# Altium schematic sheet Printing.SchDoc (part 1 of 2)
size A2; Organization: Altium Limited; Address1: L3, 12a Rodborough Rd; Address2: Frenchs Forest; Address3: NSW; Address4: Australia 2086
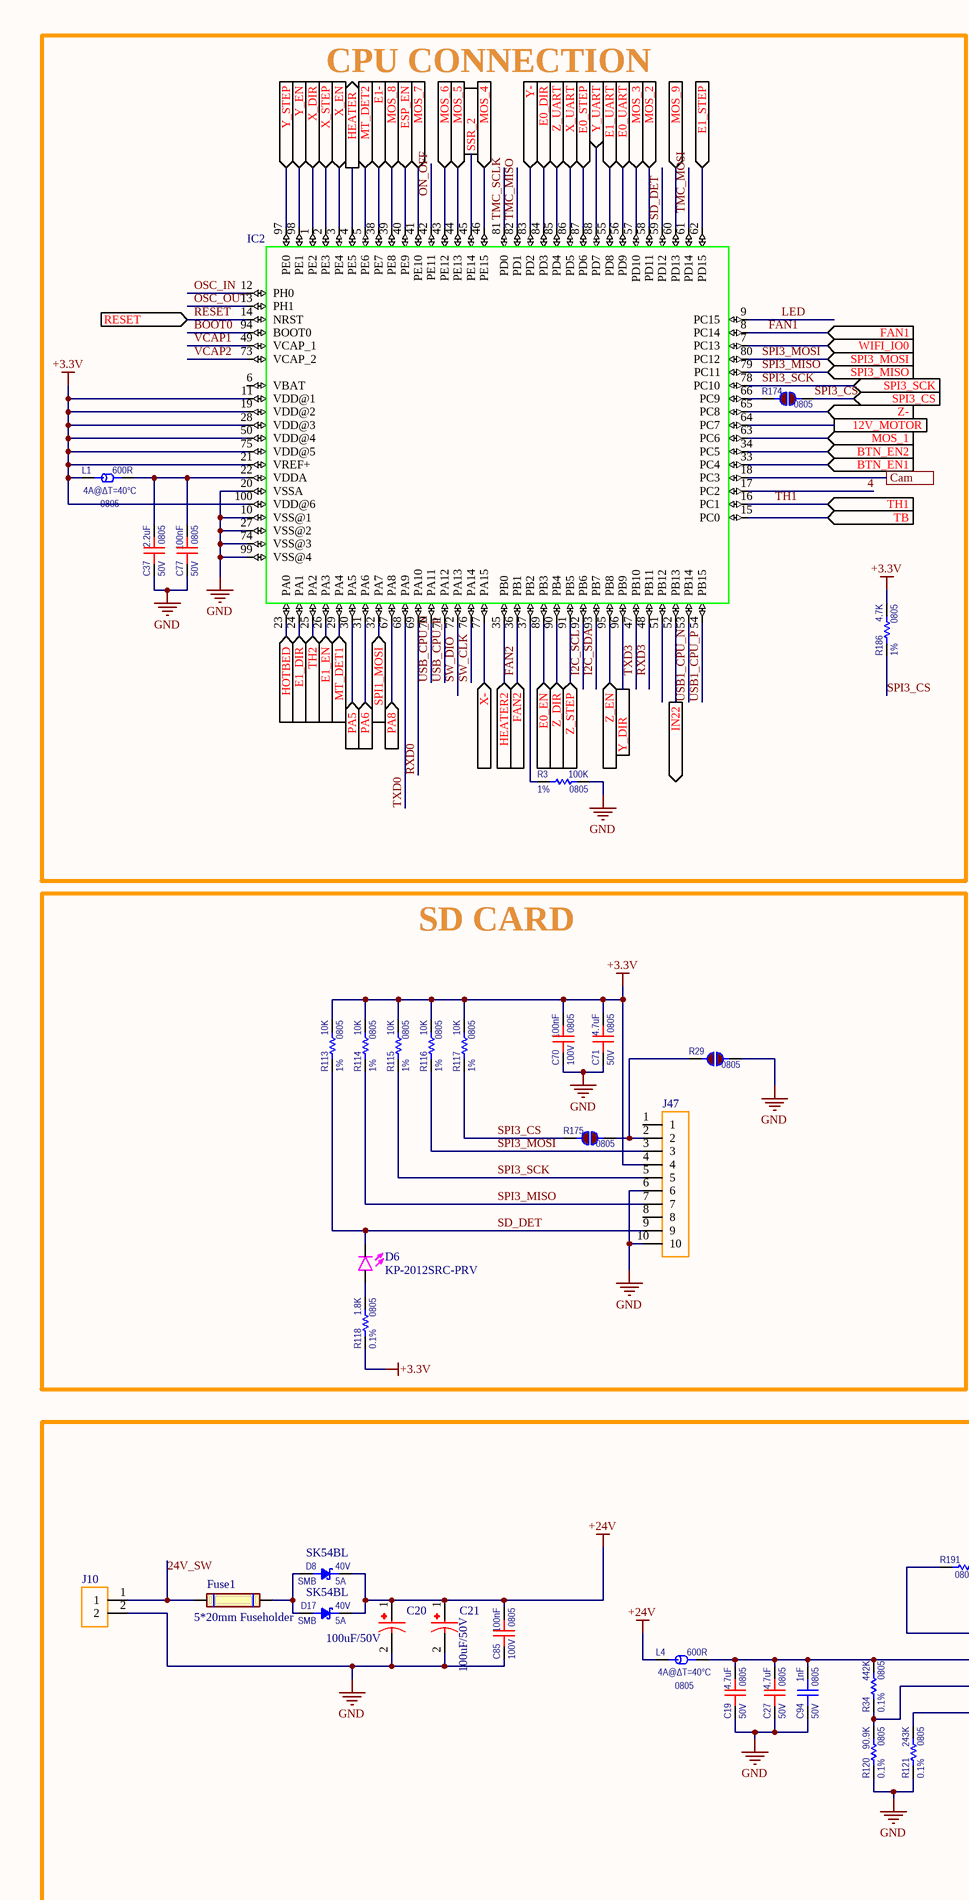
[diagram p0: Printing.SchDoc, left]
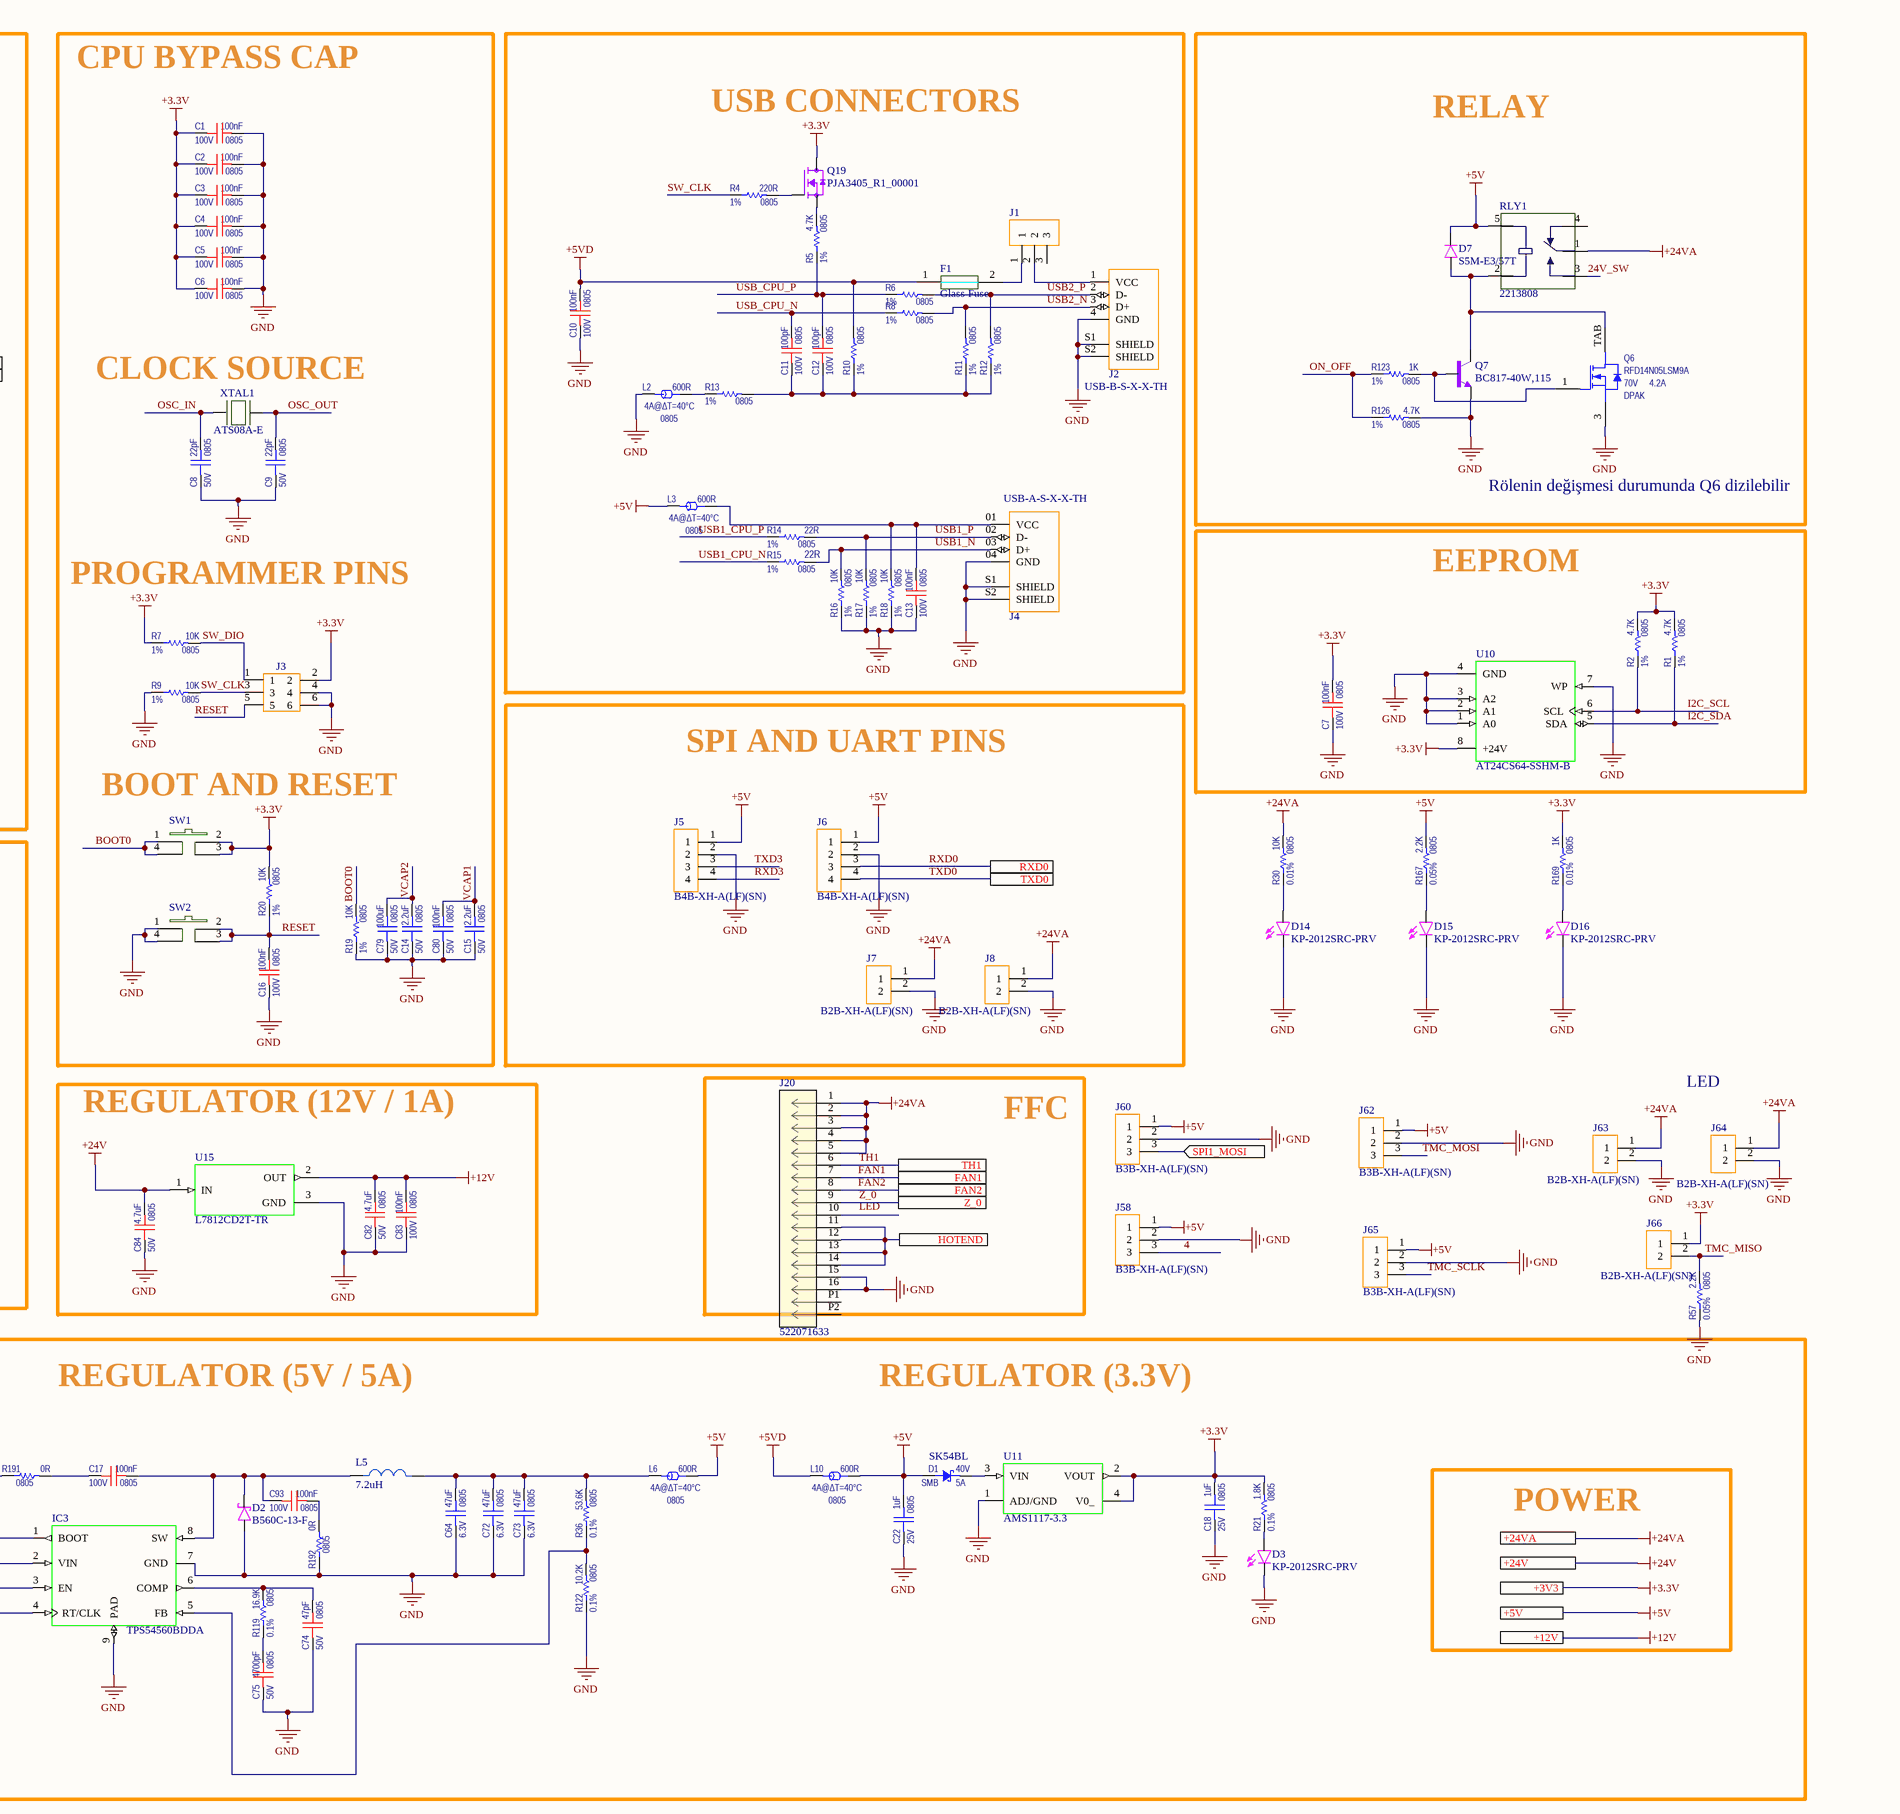
[diagram p1: Printing.SchDoc, right]

## Parts
C1  value 100nF  Voltage: 100V  Package: 0805  [C_0805_GEN_1.40H]  (hidden comment: ESDSafeCapacitor)
C2  value 100nF  Voltage: 100V  Package: 0805  [C_0805_GEN_1.40H]  (hidden comment: ESDSafeCapacitor)
C3  value 100nF  Voltage: 100V  Package: 0805  [C_0805_GEN_1.40H]  (hidden comment: ESDSafeCapacitor)
C4  value 100nF  Voltage: 100V  Package: 0805  [C_0805_GEN_1.40H]  (hidden comment: ESDSafeCapacitor)
C5  value 100nF  Voltage: 100V  Package: 0805  [C_0805_GEN_1.40H]  (hidden comment: ESDSafeCapacitor)
C6  value 100nF  Voltage: 100V  Package: 0805  [C_0805_GEN_1.40H]  (hidden comment: ESDSafeCapacitor)
C7  value 100nF  Voltage: 100V  Package: 0805  [C_0805_GEN_1.40H]  (hidden comment: ESDSafeCapacitor)
C8  value 22pF  Voltage: 50V  Package: 0805  [C_0805_GEN_1.10H]  (hidden comment: Capacitor)
C9  value 22pF  Voltage: 50V  Package: 0805  [C_0805_GEN_1.10H]  (hidden comment: Capacitor)
C10  value 100nF  Voltage: 100V  Package: 0805  [C_0805_GEN_1.40H]  (hidden comment: ESDSafeCapacitor)
C11  value 100pF  Voltage: 100V  Package: 0805  [C_0805_GEN_1.40H]  (hidden comment: ESDSafeCapacitor)
C12  value 100pF  Voltage: 100V  Package: 0805  [C_0805_GEN_1.40H]  (hidden comment: ESDSafeCapacitor)
C13  value 100nF  Voltage: 100V  Package: 0805  [C_0805_GEN_1.40H]  (hidden comment: ESDSafeCapacitor)
C14  value 2.2uF  Voltage: 50V  Package: 0805  [C_0805_GEN_1.40H]  (hidden comment: Capacitor)
C15  value 2.2uF  Voltage: 50V  Package: 0805  [C_0805_GEN_1.40H]  (hidden comment: Capacitor)
C16  value 100nF  Voltage: 100V  Package: 0805  [C_0805_GEN_1.40H]  (hidden comment: ESDSafeCapacitor)
C17  value 100nF  Voltage: 100V  Package: 0805  [C_0805_GEN_1.40H]  (hidden comment: ESDSafeCapacitor)
C18  value 1uF  Voltage: 25V  Package: 0805  [C_0805_GEN_1.40H]  (hidden comment: Capacitor)
C19  value 4.7uF  Voltage: 50V  Package: 0805  [C_0805_GEN_1.40H]  (hidden comment: ESDSafeCapacitor)
C20  100uF/50V  [SC1V107M6L07KVR]
C21  100uF/50V  [SC1V107M6L07KVR]
C22  value 1uF  Voltage: 25V  Package: 0805  [C_0805_GEN_1.40H]  (hidden comment: Capacitor)
C27  value 4.7uF  Voltage: 50V  Package: 0805  [C_0805_GEN_1.40H]  (hidden comment: ESDSafeCapacitor)
C37  value 2.2uF  Voltage: 50V  Package: 0805  [C_0805_GEN_1.40H]  (hidden comment: ESDSafeCapacitor)
C64  value 47uF  Voltage: 6.3V  Package: 0805  [C_0805_GEN_1.40H]  (hidden comment: Capacitor)
C70  value 100nF  Voltage: 100V  Package: 0805  [C_0805_GEN_1.40H]  (hidden comment: ESDSafeCapacitor)
C71  value 4.7uF  Voltage: 50V  Package: 0805  [C_0805_GEN_1.40H]  (hidden comment: ESDSafeCapacitor)
C72  value 47uF  Voltage: 6.3V  Package: 0805  [C_0805_GEN_1.40H]  (hidden comment: Capacitor)
C73  value 47uF  Voltage: 6.3V  Package: 0805  [C_0805_GEN_1.40H]  (hidden comment: Capacitor)
C74  value 47pF  Voltage: 50V  Package: 0805  [C_0805_GEN_1.40H]  (hidden comment: ESDSafeCapacitor)
C75  value 4700pF  Voltage: 50V  Package: 0805  [C_0805_GEN_1.40H]  (hidden comment: ESDSafeCapacitor)
C77  value 100nF  Voltage: 50V  Package: 0805  [C_0805_GEN_1.40H]  (hidden comment: ESDSafeCapacitor)
C79  value 100uF  Voltage: 50V  Package: 0805  [C_0805_GEN_1.40H]  (hidden comment: Capacitor)
C80  value 100nF  Voltage: 50V  Package: 0805  [C_0805_GEN_1.40H]  (hidden comment: Capacitor)
C82  value 4.7uF  Voltage: 50V  Package: 0805  [C_0805_GEN_1.40H]  (hidden comment: ESDSafeCapacitor)
C83  value 100nF  Voltage: 100V  Package: 0805  [C_0805_GEN_1.40H]  (hidden comment: ESDSafeCapacitor)
C84  value 4.7uF  Voltage: 50V  Package: 0805  [C_0805_GEN_1.40H]  (hidden comment: ESDSafeCapacitor)
C85  value 100nF  Voltage: 100V  Package: 0805  [C_0805_GEN_1.40H]  (hidden comment: ESDSafeCapacitor)
C93  value 100nF  Voltage: 100V  Package: 0805  [C_0805_GEN_1.40H]  (hidden comment: ESDSafeCapacitor)
C94  value 1nF  Voltage: 50V  Package: 0805  [C_0805_GEN_0.70H]  (hidden comment: Capacitor)
D1  SK54BL  Voltage: 40V  Current: 5A  Package: SMB  [SMB_NRVBS360BT3G]
D2  B560C-13-F  [B560C-13-F]
D3  KP-2012SRC-PRV  [0805 LED]
D6  KP-2012SRC-PRV  [0805 LED]
D7  S5M-E3/57T  [B560C-13-F]
D8  SK54BL  Voltage: 40V  Current: 5A  Package: SMB  [SMB_NRVBS360BT3G]
D14  KP-2012SRC-PRV  [0805 LED]
D15  KP-2012SRC-PRV  [0805 LED]
D16  KP-2012SRC-PRV  [0805 LED]
D17  SK54BL  Voltage: 40V  Current: 5A  Package: SMB  [SMB_NRVBS360BT3G]
F1  Glass Fuse  [2410 Sigorta]
Fuse1  5*20mm Fuseholder  [696310001002]
IC2  MCU-STM32F407VET6(LQFP100)  [LQFP100-0.5-13.8X13.8MM]  (value not drawn)
IC3  TPS54560BDDA  [VREG_LM5017MR/NOPB]
J1  L-KLS1-207-1-03-S  [L-KLS1-207-1-03-S]  (value not drawn)
J2  USB-B-S-X-X-TH  [SAMTEC_USB-B-S-X-X-TH]
J3  5PH1SDA25-203G0NNBL-3X6  [5PH1SDA25-203G0NNBL-3X6]  (value not drawn)
J4  USB-A-S-X-X-TH  [SAMTEC_USB-A-S-X-X-TH]
J5  B4B-XH-A(LF)(SN)  [JST_B4B-XH-A(LF)(SN)]
J6  B4B-XH-A(LF)(SN)  [JST_B4B-XH-A(LF)(SN)]
J7  B2B-XH-A(LF)(SN)  [JST_B2B-XH-A(LF)(SN)]
J8  B2B-XH-A(LF)(SN)  [JST_B2B-XH-A(LF)(SN)]
J10  5.08 Klemens  [5.08 Klemens]  (value not drawn)
J20  522071633  [CON_522071633_MOL]
J47  BH10B-XH-2(LF)(SN)  [BH10B-XH-2(LF)(SN)]  (value not drawn)
J58  B3B-XH-A(LF)(SN)  [JST_B3B-XH-A(LF)(SN)]
J60  B3B-XH-A(LF)(SN)  [JST_B3B-XH-A(LF)(SN)]
J62  B3B-XH-A(LF)(SN)  [JST_B3B-XH-A(LF)(SN)]
J63  B2B-XH-A(LF)(SN)  [JST_B2B-XH-A(LF)(SN)]
J64  B2B-XH-A(LF)(SN)  [JST_B2B-XH-A(LF)(SN)]
J65  B3B-XH-A(LF)(SN)  [JST_B3B-XH-A(LF)(SN)]
J66  B2B-XH-A(LF)(SN)  [JST_B2B-XH-A(LF)(SN)]
L1  value 600R  Current: 4A@ΔT=40°C  Package: 0805  [FB_0805_GEN_1.10H]  (hidden comment: FerriteBead)
L2  value 600R  Current: 4A@ΔT=40°C  Package: 0805  [FB_0805_GEN_1.10H]  (hidden comment: FerriteBead)
L3  value 600R  Current: 4A@ΔT=40°C  Package: 0805  [FB_0805_GEN_1.10H]  (hidden comment: FerriteBead)
L4  value 600R  Current: 4A@ΔT=40°C  Package: 0805  [FB_0805_GEN_1.10H]  (hidden comment: FerriteBead)
L5  7.2uH  [7447798720]
L6  value 600R  Current: 4A@ΔT=40°C  Package: 0805  [FB_0805_GEN_1.10H]  (hidden comment: FerriteBead)
L10  value 600R  Current: 4A@ΔT=40°C  Package: 0805  [FB_0805_GEN_1.10H]  (hidden comment: FerriteBead)
Q6  value RFD14N05LSM9A  Current: 4.2A  Voltage: 70V  Package: DPAK  [DPAK_SQD50N10-8M9L]  (hidden comment: SingleNMOS_G1S3DTAB)
Q7  BC817-40W,115  [BC817-40W,115]
Q19  PJA3405_R1_00001  [PJA3405_R1_00001]
R1  value 4.7K  Tolerance: 1%  Package: 0805  [R_0805_GEN_0.60H]  (hidden comment: StandardResistor)
R2  value 4.7K  Tolerance: 1%  Package: 0805  [R_0805_GEN_0.60H]  (hidden comment: StandardResistor)
R3  value 100K  Tolerance: 1%  Package: 0805  [R_0805_GEN_0.70H]  (hidden comment: StandardResistor)
R4  value 220R  Tolerance: 1%  Package: 0805  [R_0805_GEN_0.60H]  (hidden comment: StandardResistor)
R5  value 4.7K  Tolerance: 1%  Package: 0805  [R_0805_GEN_0.60H]  (hidden comment: StandardResistor)
R6  Tolerance: 1%  Package: 0805  [R_0805_GEN_0.60H]  (hidden comment: StandardResistor)
R7  value 10K  Tolerance: 1%  Package: 0805  [R_0805_GEN_0.70H]  (hidden comment: StandardResistor)
R8  Tolerance: 1%  Package: 0805  [R_0805_GEN_0.60H]  (hidden comment: StandardResistor)
R9  value 10K  Tolerance: 1%  Package: 0805  [R_0805_GEN_0.70H]  (hidden comment: StandardResistor)
R10  Tolerance: 1%  Package: 0805  [R_0805_GEN_0.60H]  (hidden comment: StandardResistor)
R11  Tolerance: 1%  Package: 0805  [R_0805_GEN_0.60H]  (hidden comment: StandardResistor)
R12  Tolerance: 1%  Package: 0805  [R_0805_GEN_0.60H]  (hidden comment: StandardResistor)
R13  Tolerance: 1%  Package: 0805  [R_0805_GEN_0.60H]  (hidden comment: StandardResistor)
R14  22R  Tolerance: 1%  Package: 0805  [R_0805_GEN_0.60H]
R15  22R  Tolerance: 1%  Package: 0805  [R_0805_GEN_0.60H]
R16  value 10K  Tolerance: 1%  Package: 0805  [R_0805_GEN_0.70H]  (hidden comment: StandardResistor)
R17  value 10K  Tolerance: 1%  Package: 0805  [R_0805_GEN_0.70H]  (hidden comment: StandardResistor)
R18  value 10K  Tolerance: 1%  Package: 0805  [R_0805_GEN_0.70H]  (hidden comment: StandardResistor)
R19  value 10K  Tolerance: 1%  Package: 0805  [R_0805_GEN_0.70H]  (hidden comment: StandardResistor)
R20  value 10K  Tolerance: 1%  Package: 0805  [R_0805_GEN_0.70H]  (hidden comment: StandardResistor)
R21  value 1.8K  Tolerance: 0.1%  Package: 0805  [R_0805_GEN_0.70H]  (hidden comment: StandardResistor)
R29  Package: 0805  [R_0805_GEN_0.70H]  (hidden comment: StandardJumper)
R30  value 10K  Tolerance: 0.01%  Package: 0805  [R_0805_GEN_0.70H]  (hidden comment: StandardResistor)
R34  value 442K  Tolerance: 0.1%  Package: 0805  [R_0805_GEN_0.70H]  (hidden comment: StandardResistor)
R36  value 53.6K  Tolerance: 0.1%  Package: 0805  [R_0805_GEN_0.70H]  (hidden comment: StandardResistor)
R57  value 2.2K  Tolerance: 0.05%  Package: 0805  [R_0805_GEN_0.70H]  (hidden comment: StandardResistor)
R113  value 10K  Tolerance: 1%  Package: 0805  [R_0805_GEN_0.70H]  (hidden comment: StandardResistor)
R114  value 10K  Tolerance: 1%  Package: 0805  [R_0805_GEN_0.70H]  (hidden comment: StandardResistor)
R115  value 10K  Tolerance: 1%  Package: 0805  [R_0805_GEN_0.70H]  (hidden comment: StandardResistor)
R116  value 10K  Tolerance: 1%  Package: 0805  [R_0805_GEN_0.70H]  (hidden comment: StandardResistor)
R117  value 10K  Tolerance: 1%  Package: 0805  [R_0805_GEN_0.70H]  (hidden comment: StandardResistor)
R118  value 1.8K  Tolerance: 0.1%  Package: 0805  [R_0805_GEN_0.70H]  (hidden comment: StandardResistor)
R119  value 16.9K  Tolerance: 0.1%  Package: 0805  [R_0805_GEN_0.70H]  (hidden comment: StandardResistor)
R120  value 90.9K  Tolerance: 0.1%  Package: 0805  [R_0805_GEN_0.70H]  (hidden comment: StandardResistor)
R121  value 243K  Tolerance: 0.1%  Package: 0805  [R_0805_GEN_0.70H]  (hidden comment: StandardResistor)
R122  value 10.2K  Tolerance: 0.1%  Package: 0805  [R_0805_GEN_0.70H]  (hidden comment: StandardResistor)
R123  1K  Tolerance: 1%  Package: 0805  [R_0805_GEN_0.60H]
R126  value 4.7K  Tolerance: 1%  Package: 0805  [R_0805_GEN_0.60H]  (hidden comment: StandardResistor)
R167  value 2.2K  Tolerance: 0.05%  Package: 0805  [R_0805_GEN_0.70H]  (hidden comment: StandardResistor)
R169  value 1K  Tolerance: 0.01%  Package: 0805  [R_0805_GEN_0.70H]  (hidden comment: StandardResistor)
R174  Package: 0805  [R_0805_GEN_0.70H]  (hidden comment: StandardJumper)
R175  Package: 0805  [R_0805_GEN_0.70H]  (hidden comment: StandardJumper)
R186  value 4.7K  Tolerance: 1%  Package: 0805  [R_0805_GEN_0.60H]  (hidden comment: StandardResistor)
R191  value 0R  Package: 0805  [R_0805_GEN_0.70H]  (hidden comment: PlaceHolder)
R192  value 0R  Package: 0805  [R_0805_GEN_0.70H]  (hidden comment: PlaceHolder)
RLY1  Supplier Part Number 1: 2213808  [relay]  (hidden comment: G5RL-1A-E-HR-DC24)
SW1  L-KLS7-TS4502-6.5-180-T  [L-KLS7-TS4502-6.5-180-T]  (value not drawn)
SW2  L-KLS7-TS4502-6.5-180-T  [L-KLS7-TS4502-6.5-180-T]  (value not drawn)
U10  AT24CS64-SSHM-B  [SOIC127P599X175-8N]
U11  AMS1117-3.3  [SOT229P700X180-4N]
U15  L7812CD2T-TR  [TO254P1515X470-3N]
XTAL1  ATS08A-E  [XTAL_HC49P488W43L1085T450H368]

## Blocks framed on the sheet
CPU CONNECTION: C37 C77 IC2 L1 R3 R174 R186
USB CONNECTORS: C10-C13 F1 J1 J2 J4 L2 L3 Q19 R4-R6 R8 R10-R18
RELAY: D7 Q6 Q7 R123 R126 RLY1
EEPROM: C7 R1 R2 U10
SPI AND UART PINS: J5-J8
SD CARD: C70 C71 D6 J47 R29 R113-R118 R175
REGULATOR (12V / 1A): C82-C84 U15
FFC: J20

## Ports
12V_MOTOR, +3V3, +5V, +12V, +24V, +24VA, BTN_EN1 (in), BTN_EN2 (in), Cam, E0_DIR (in), E0_EN (in), E0_STEP (in), E0_UART (in), E1- (in), E1_DIR (in), E1_EN (in), E1_STEP (in), E1_UART (in), ESP_EN (in), FAN1, FAN1 (in), FAN2, FAN2 (in), HEATER2 (in), HEATER (out), HOTBED (in), HOTEND, IN22 (out), MOS_1 (in), MOS_2 (in), MOS_3 (in), MOS_4 (in), MOS_5 (in), MOS_6 (in), MOS_7 (in), MOS_8 (in), MOS_9 (in), MT_DET1 (in), MT_DET2 (in), PA5 (in), PA6 (in), PA8 (in), RESET (in), RXD0, SPI1_MOSI (in), SPI3_CS (in), SPI3_MISO (in), SPI3_MOSI (in), SPI3_SCK (in), SSR_2, TB (in), TH1, TH1 (in), TH2 (in), TXD0, WIFI_IO0 (in), X- (in), X_DIR (in), X_EN (in), X_STEP (in), X_UART (in), Y- (in), Y_DIR, Y_EN (in), Y_STEP (in), Y_UART (in), Z- (in), Z_0, Z_DIR (in), Z_EN (in), Z_STEP (in), Z_UART (in)

## Nets
+3.3V: C1.1 C2.1 C3.1 C4.1 C5.1 C6.1 C7.2 C18.2 C70.2 C71.2 IC2.11(VDD@1) IC2.19(VDD@2) IC2.21(VREF+) IC2.28(VDD@3) IC2.50(VDD@4) IC2.75(VDD@5) IC2.100(VDD@6) J3.2 J47.4 J66.1 L1.1 Q19.3(D) R1.2 R2.2 R7.1 R20.2 R21.2 R113.2 R114.2 R115.2 R116.2 R117.2 R118.1 R169.2 R186.2 SW1.2(B0) SW1.3(B1) U10.8(+24V) U11.2(VOUT) U11.4(V0_) ; port +3V3
+5V: C22.2 D1.2(A) D7.K J5.1 J6.1 J58.1 J60.1 J62.1 J65.1 L3.1 L6.2 L10.2 R167.2 RLY1.5(COIL1) ; port +5V
+5VD: C10.2 F1.1 L10.1 R10.2
+12V: C82.2 C83.2 U15.2(OUT) ; port +12V
+24V: C20.1 C21.1 C84.2 C85.2 D8.1(C) D17.1(C) L4.1 U15.1(IN) ; port +24V
+24VA: J7.1 J8.1 J20.1 J20.2 J20.3 J20.4 J20.5 J63.1 J64.1 R30.2 RLY1.1(COM) ; port +24VA
GND: C1.2 C2.2 C3.2 C4.2 C5.2 C6.2 C7.1 C8.1 C9.1 C10.1 C13.1 C14.1 C15.1 C16.1 C18.1 C19.1 C20.2 C21.2 C22.1 C27.1 C37.1 C64.1 C70.1 C71.1 C72.1 C73.1 C74.1 C75.1 C77.1 C79.1 C80.1 C82.1 C83.1 C84.1 C85.1 C94.1 D2.A D3.K(C) D14.K(C) D15.K(C) D16.K(C) IC2.10(VSS@1) IC2.20(VSSA) IC2.27(VSS@2) IC2.74(VSS@3) IC2.99(VSS@4) IC3.7(GND) IC3.9(PAD) J2.4(GND) J2.S1(SHIELD) J2.S2(SHIELD) J3.4 J3.6 J4.04(GND) J4.S1(SHIELD) J4.S2(SHIELD) J5.2 J6.2 J7.2 J8.2 J10.2 J20.15 J20.16 J47.6 J47.10 J58.2 J60.2 J62.2 J63.2 J64.2 J65.2 L2.1 Q6.3(SOURCE) Q7.2(E) R3.2 R9.1 R16.1 R17.1 R18.1 R19.1 R29.2 R57.1 R120.1 R121.1 R122.1 R126.2 R192.1 SW2.1(A0) SW2.4(A1) U10.1(A0) U10.2(A1) U10.3(A2) U10.4(GND) U10.7(WP) U11.1(ADJ/GND) U15.3(GND)
4: IC2.17(PC2) J58.3
12V_MOTOR: IC2.64(PC7) ; port 12V_MOTOR
24V_SW: Fuse1.1 J10.1 RLY1.3(NO)
BOOT0: IC2.94(BOOT0) R19.2 SW1.1(A0) SW1.4(A1)
BTN_EN1: IC2.33(PC4) ; port BTN_EN1
BTN_EN2: IC2.34(PC5) ; port BTN_EN2
Cam: IC2.18(PC3) ; port Cam
E0_DIR: IC2.84(PD3) ; port E0_DIR
E0_EN: IC2.89(PB3) ; port E0_EN
E0_STEP: IC2.87(PD6) ; port E0_STEP
E0_UART: IC2.56(PD9) ; port E0_UART
E1-: IC2.38(PE7) ; port E1-
E1_DIR: IC2.24(PA1) ; port E1_DIR
E1_EN: IC2.26(PA3) ; port E1_EN
E1_STEP: IC2.62(PD15) ; port E1_STEP
E1_UART: IC2.55(PD8) ; port E1_UART
ESP_EN: IC2.40(PE9) ; port ESP_EN
FAN1: IC2.8(PC14) J20.7 ; port FAN1
FAN2: IC2.36(PB1) J20.8 ; port FAN2
HEATER: IC2.4(PE5) ; port HEATER
HEATER2: IC2.35(PB0) ; port HEATER2
HOTBED: IC2.23(PA0) ; port HOTBED
HOTEND: J20.11 J20.12 J20.13 J20.14 ; port HOTEND
I2C_SCL: IC2.92(PB6) R2.1 U10.6(SCL)
I2C_SDA: IC2.93(PB7) R1.1 U10.5(SDA)
IN22: IC2.52(PB13) ; port IN22
LED: IC2.9(PC15)
MOS_1: IC2.63(PC6) ; port MOS_1
MOS_2: IC2.58(PD11) ; port MOS_2
MOS_3: IC2.57(PD10) ; port MOS_3
MOS_4: IC2.46(PE15) ; port MOS_4
MOS_5: IC2.44(PE13) ; port MOS_5
MOS_6: IC2.43(PE12) ; port MOS_6
MOS_7: IC2.41(PE10) ; port MOS_7
MOS_8: IC2.39(PE8) ; port MOS_8
MOS_9: IC2.60(PD13) ; port MOS_9
MT_DET1: IC2.29(PA4) ; port MT_DET1
MT_DET2: IC2.5(PE6) ; port MT_DET2
ON_OFF: IC2.42(PE11) R123.1 R126.1
OSC_IN: C8.2 IC2.12(PH0) XTAL1.1
OSC_OUT: C9.2 IC2.13(PH1) XTAL1.2
PA5: IC2.30(PA5) ; port PA5
PA6: IC2.31(PA6) ; port PA6
PA8: IC2.67(PA8) ; port PA8
RESET: C16.2 IC2.14(NRST) J3.5 R20.1 SW2.2(B0) SW2.3(B1) ; port RESET
RXD0: IC2.69(PA10) J6.3 ; port RXD0
RXD3: IC2.48(PB11) J5.4
SD_DET: D6.K(C) IC2.59(PD12) J47.9 R113.1
SPI1_MOSI: IC2.32(PA7) J60.3 ; port SPI1_MOSI
SPI3_CS: R117.1 R174.2 R175.1 R186.1 ; port SPI3_CS
SPI3_MISO: IC2.79(PC11) J47.7 R114.1 ; port SPI3_MISO
SPI3_MOSI: IC2.80(PC12) J47.3 R116.1 ; port SPI3_MOSI
SPI3_SCK: IC2.78(PC10) J47.5 R115.1 ; port SPI3_SCK
SSR_2: IC2.45(PE14) ; port SSR_2
SW_CLK: IC2.76(PA14) J3.3 R4.1 R9.2
SW_DIO: IC2.72(PA13) J3.1 R7.2
TB: IC2.15(PC0) ; port TB
TH1: IC2.16(PC1) J20.6 ; port TH1
TH2: IC2.25(PA2) ; port TH2
TMC_MISO: IC2.82(PD1) J66.2 R57.2
TMC_MOSI: IC2.61(PD14) J62.3
TMC_SCLK: IC2.81(PD0) J65.3
TXD0: IC2.68(PA9) J6.4 ; port TXD0
TXD3: IC2.47(PB10) J5.3
USB1_CPU_N: IC2.53(PB14) R15.1
USB1_CPU_P: IC2.54(PB15) R14.1
USB1_N: J4.03(D+) R15.2 R16.2
USB1_P: J4.02(D-) R14.2 R17.2
USB2_N: J2.3(D+) R8.2 R11.2
USB2_P: J2.2(D-) R6.2 R12.2
USB_CPU_N: C11.2 IC2.70(PA11) R8.1
USB_CPU_P: C12.2 IC2.71(PA12) R5.1 R6.1
VCAP1: C15.2 C80.2 IC2.49(VCAP_1)
VCAP2: C14.2 C79.2 IC2.73(VCAP_2)
WIFI_IO0: IC2.7(PC13) ; port WIFI_IO0
X-: IC2.77(PA15) ; port X-
X_DIR: IC2.1(PE2) ; port X_DIR
X_EN: IC2.3(PE4) ; port X_EN
X_STEP: IC2.2(PE3) ; port X_STEP
X_UART: IC2.86(PD5) ; port X_UART
Y-: IC2.83(PD2) ; port Y-
Y_DIR: IC2.96(PB9) ; port Y_DIR
Y_EN: IC2.98(PE1) ; port Y_EN
Y_STEP: IC2.97(PE0) ; port Y_STEP
Y_UART: IC2.88(PD7) ; port Y_UART
Z-: IC2.65(PC8) ; port Z-
Z_0: J20.9 ; port Z_0
Z_DIR: IC2.90(PB4) ; port Z_DIR
Z_EN: IC2.95(PB8) ; port Z_EN
Z_STEP: IC2.91(PB5) ; port Z_STEP
Z_UART: IC2.85(PD4) ; port Z_UART
NetC11_1: C11.1 C12.1 R10.1 R11.1 R12.1 R13.2
NetC13_2: C13.2 J4.01(VCC) L3.2 R18.2
NetC17_1: C17.1 R191.2
NetC17_2: C17.2 C93.1 D2.K IC3.8(SW) L5.1
NetC19_2: C19.2 C27.2 C94.2 IC3.2(VIN) L4.2 R34.2
NetC37_2: C37.2 C77.2 IC2.22(VDDA) L1.2
NetC64_2: C64.2 C72.2 C73.2 L5.2 L6.1 R36.2
NetC74_2: C74.2 IC3.6(COMP) R119.2
NetC75_2: C75.2 R119.1
NetC93_2: C93.2 R192.2
NetD1_1: D1.1(C) U11.3(VIN)
NetD3_A: D3.A R21.1
NetD6_A: D6.A R118.2
NetD7_A: D7.A Q6.TAB(DRAIN) Q7.3(C) RLY1.2(COIL2)
NetD8_2: D8.2(A) D17.2(A) Fuse1.2
NetD14_A: D14.A R30.1
NetD15_A: D15.A R167.1
NetD16_A: D16.A R169.1
NetF1_2: F1.2 J1.1
NetIC2_37: IC2.37(PB2) R3.1
NetIC2_66: IC2.66(PC9) R174.1
NetIC3_1: IC3.1(BOOT) R191.1
NetIC3_3: IC3.3(EN) R34.1 R120.2
NetIC3_4: IC3.4(RT/CLK) R121.2
NetIC3_5: IC3.5(FB) R36.1 R122.2
NetJ1_2: J1.2 J2.1(VCC)
NetJ47_2: J47.2 R29.1 R175.2
NetL2_2: L2.2 R13.1
NetQ6_1: Q6.1(GATE) Q7.1(B) R123.2
NetQ19_1: Q19.1(G) R4.2
NetQ19_2: Q19.2(S) R5.2

Not connected (* = marked no-connect by the designer): IC2 6(VBAT) 51(PB12); J1 3; J20 10 P1 P2; J47 1 8; RLY1 4(NC)

## Notes on the sheet
- CPU BYPASS CAP
- (near XTAL1) CLOCK SOURCE
- Rölenin değişmesi durumunda Q6 dizilebilir
- PROGRAMMER PINS
- (near SW1) BOOT AND RESET
- LED
- REGULATOR (5V / 5A)
- REGULATOR (3.3V)
- POWER
- Labels drawn without touching a wire or pin: LED
- Title
- Size:
- Date:
- File:
- A2
- Number:
- Time:
- Revision:
- Sheet
- of